# Altium schematic sheet root.SchDoc: PROJECT DIAGRAM
size A2; ApprovedBy: ---; CheckedBy: ---; CompanyName: BINHANH ELECTRONICS; DrawnBy: BienNB; DocumentNumber: 1; Revision: V1.0; SheetNumber: 1; SheetTotal: 11; PageSetup: Record=PageOptions|CenterHorizontal=True|CenterVertical=True|PrintScale=1.07|XCorrection=1.00|YCorrection=1.00|PrintKind=1|BorderSize=5000000|LeftOffset=0|BottomOffset=0|Orientation=2|PaperLength=1000|PaperWidth=1000|Scale=100|PaperSource=7|PrintQuality=600|MediaType=1|DitherType=10|PaperKind=A3|PrintScaleMode=1; Stage: DRAFT
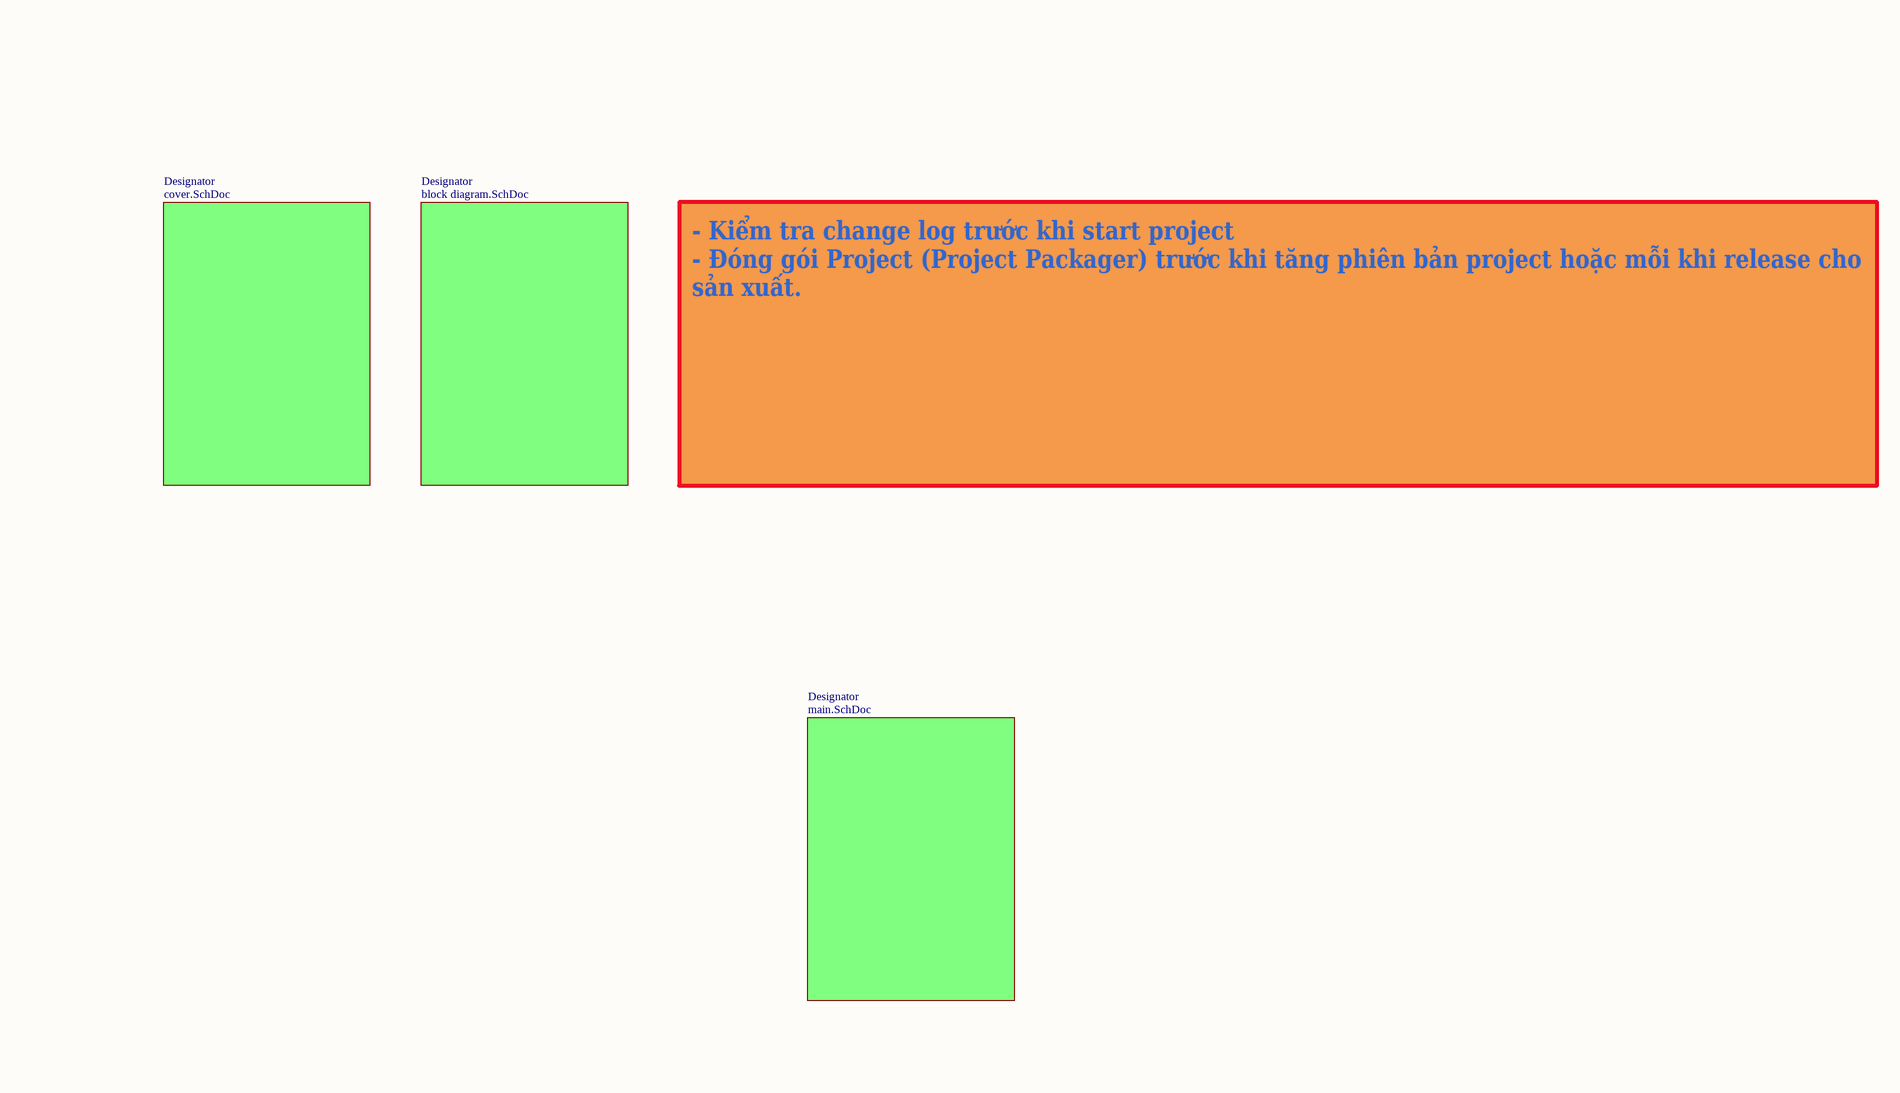
[diagram p0: root.SchDoc, left]
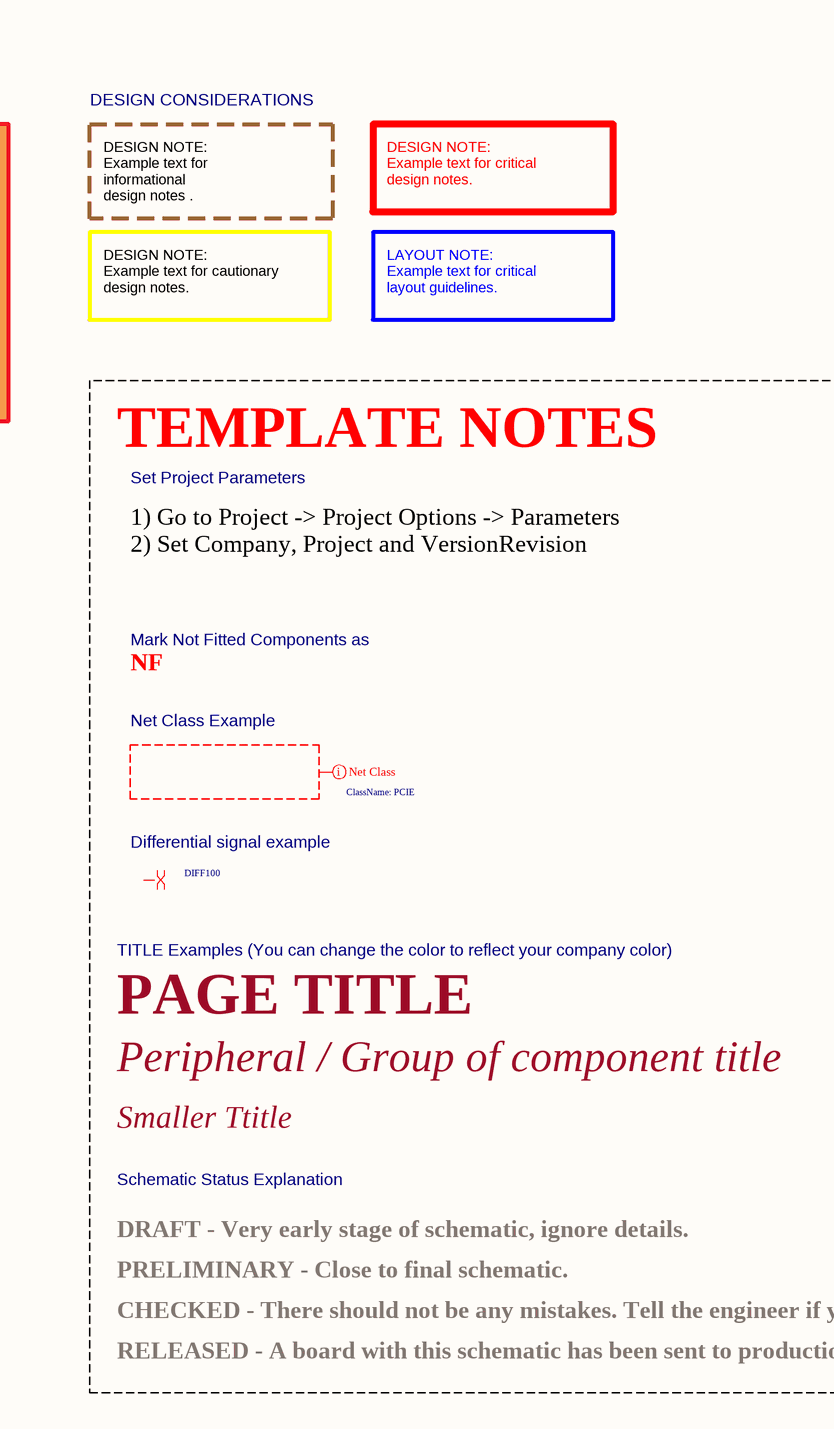
[diagram p1: root.SchDoc, right]

## Sub-sheets
Designator = cover.SchDoc: no entries
Designator = block diagram.SchDoc: no entries
Designator = main.SchDoc: no entries

## Layout directives
net class PCIE: (no net found under the mark)
differential pair; net class DIFF100: (no net found under the mark)

## Notes on the sheet
- DESIGN CONSIDERATIONS
- DESIGN NOTE:
  Example text for informational
  design notes .
- DESIGN NOTE:
  Example text for critical
  design notes.
- DESIGN NOTE:
  Example text for cautionary
  design notes.
- LAYOUT NOTE:
  Example text for critical
  layout guidelines.
- - Kiểm tra change log trước khi start project
  - Đóng gói Project (Project Packager) trước khi tăng phiên bản project hoặc mỗi khi release cho sản xuất.
- TEMPLATE NOTES
- Set Project Parameters
- 1) Go to Project -> Project Options -> Parameters
  2) Set Company, Project and VersionRevision
- NF
- Mark Not Fitted Components as
- Net Class Example
- Differential signal example
- TITLE Examples (You can change the color to reflect your company color)
- PAGE TITLE
- Peripheral / Group of component title
- Smaller Ttitle
- Schematic Status Explanation
- PRELIMINARY - Close to final schematic.
- DRAFT - Very early stage of schematic, ignore details.
- RELEASED - A board with this schematic has been sent to production.
- CHECKED - There should not be any mistakes. Tell the engineer if you find one.
- Project:
- File:
- Size
- Rev
- A2
- Sheet
- /
- Drawn by:
- Checked by:
- Approved by: